# EAGLE schematic DINO (EAGLE 9.6.2)
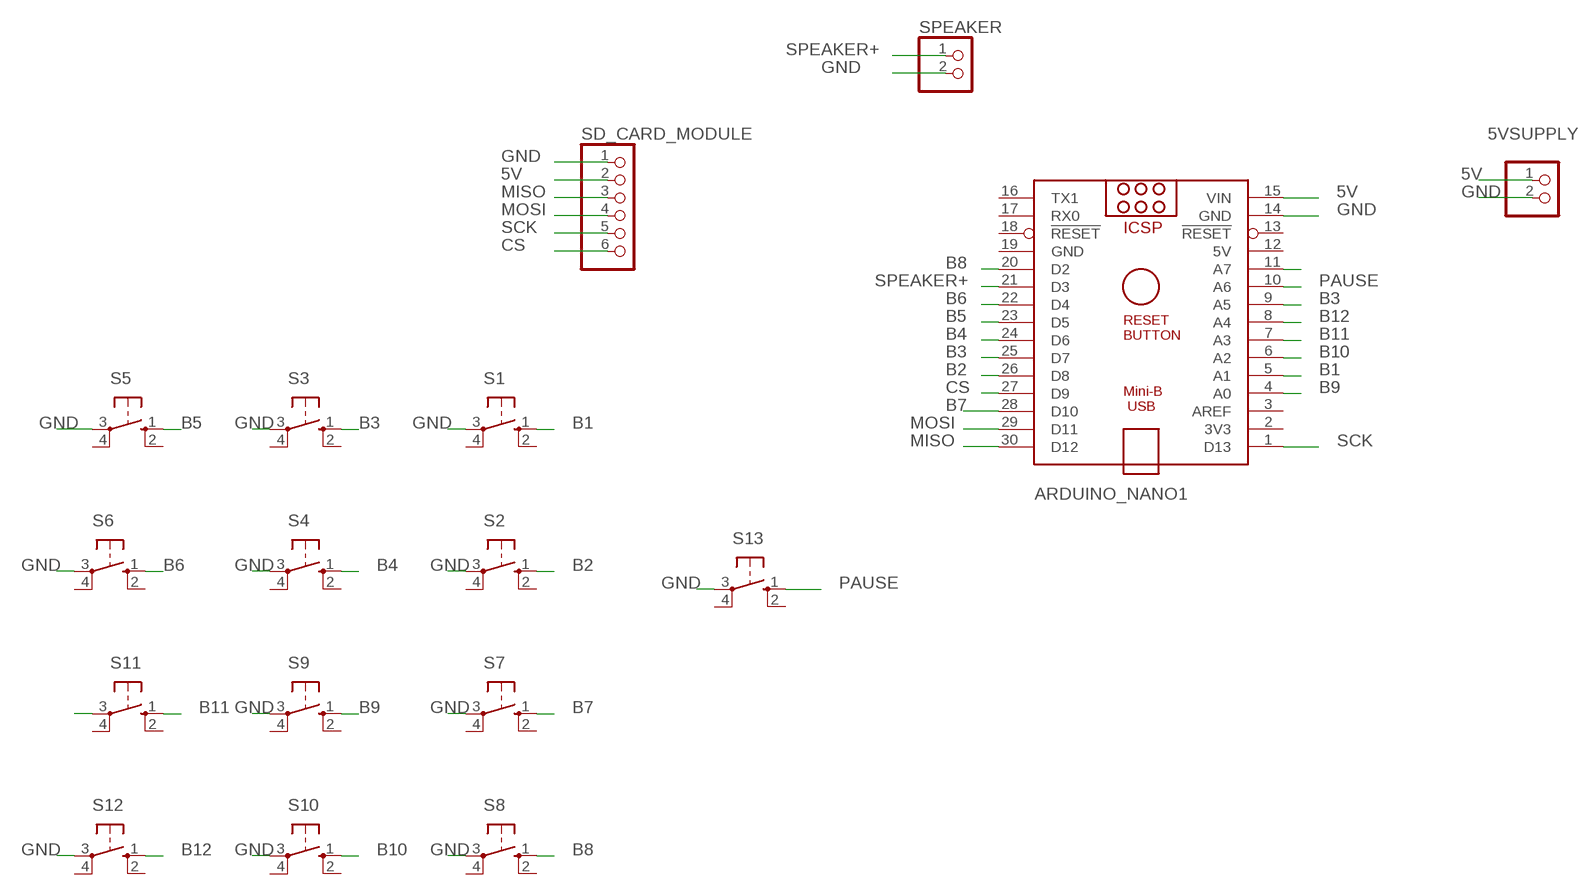
[diagram p0: schematic, sheet 1]

## Parts
5VSUPPLY  PINHD-1X2  [1X02]
ARDUINO_NANO1  ARDUINO_NANO  [ARDUINO_NANO]
S1  10-XX  [B3F-10XX]
S2  10-XX  [B3F-10XX]
S3  10-XX  [B3F-10XX]
S4  10-XX  [B3F-10XX]
S5  10-XX  [B3F-10XX]
S6  10-XX  [B3F-10XX]
S7  10-XX  [B3F-10XX]
S8  10-XX  [B3F-10XX]
S9  10-XX  [B3F-10XX]
S10  10-XX  [B3F-10XX]
S11  10-XX  [B3F-10XX]
S12  10-XX  [B3F-10XX]
S13  10-XX  [B3F-10XX]
SD_CARD_MODULE  PINHD-1X6  [1X06]
SPEAKER  PINHD-1X2  [1X02]

## Nets
5V: 5VSUPPLY.1 ARDUINO_NANO1.15(VIN) SD_CARD_MODULE.2
B1: ARDUINO_NANO1.5(A1) S1.1(S)
B2: ARDUINO_NANO1.26(D8) S2.1(S)
B3: ARDUINO_NANO1.9(A5) ARDUINO_NANO1.25(D7) S3.1(S)
B4: ARDUINO_NANO1.24(D6) S4.1(S)
B5: ARDUINO_NANO1.23(D5) S5.1(S)
B6: ARDUINO_NANO1.22(D4) S6.1(S)
B7: ARDUINO_NANO1.28(D10) S7.1(S)
B8: ARDUINO_NANO1.20(D2) S8.1(S)
B9: ARDUINO_NANO1.4(A0) S9.1(S)
B10: ARDUINO_NANO1.6(A2) S10.1(S)
B11: ARDUINO_NANO1.7(A3) S11.1(S)
B12: ARDUINO_NANO1.8(A4) S12.1(S)
CS: ARDUINO_NANO1.27(D9) SD_CARD_MODULE.6
GND: 5VSUPPLY.2 ARDUINO_NANO1.14(GND) S1.3(P) S2.3(P) S3.3(P) S4.3(P) S5.3(P) S6.3(P) S7.3(P) S8.3(P) S9.3(P) S10.3(P) S12.3(P) S13.3(P) SD_CARD_MODULE.1 SPEAKER.2
MISO: ARDUINO_NANO1.30(D12) SD_CARD_MODULE.3
MOSI: ARDUINO_NANO1.29(D11) SD_CARD_MODULE.4
N$7: S11.3(P)
N$10: ARDUINO_NANO1.11(A7)
PAUSE: ARDUINO_NANO1.10(A6) S13.1(S)
SCK: ARDUINO_NANO1.1(D13) SD_CARD_MODULE.5
SPEAKER+: ARDUINO_NANO1.21(D3) SPEAKER.1
Unconnected: ARDUINO_NANO1.2(3V3) ARDUINO_NANO1.3(AREF) ARDUINO_NANO1.13(!RESET) ARDUINO_NANO1.16(TX1) ARDUINO_NANO1.17(RX0) ARDUINO_NANO1.18(!RESET) S1.2(S1) S1.4(P1) S2.2(S1) S2.4(P1) S3.2(S1) S3.4(P1) S4.2(S1) S4.4(P1) S5.2(S1) S5.4(P1) S6.2(S1) S6.4(P1) S7.2(S1) S7.4(P1) S8.2(S1) S8.4(P1) S9.2(S1) S9.4(P1) S10.2(S1) S10.4(P1) S11.2(S1) S11.4(P1) S12.2(S1) S12.4(P1) S13.2(S1) S13.4(P1)

## Power pins joined to a net without a drawn wire
5V: ARDUINO_NANO1.12(5V)
GND: ARDUINO_NANO1.19(GND)

## Library data of the parts
5VSUPPLY SPEAKER = pinhead:PINHD-1X2: PIN HEADER
ARDUINO_NANO1 = ArduinoNanoV30:ARDUINO_NANO: Arduino Nano V3.0 Overview: The Arduino Nano is a small, complete, and breadboard-friendly board based on the ATmega328 (Arduino Nano 3.x) or ATmega168 (Arduino Nano 2.x). It has more or less the same functionality of the Arduino Duemilanove, but in a different package. It lacks only a DC power jack, and works with a Mini-B USB cable instead of a standard one. The Nano was designed and is being produced by Gravitech. Specifications: Microcontroller Atmel ATmega168 or ATmega328 Operating Voltage (logic level) 5 V Input Voltage (recommended) 7-12 V Input Voltage (limits) 6-20 V Digital I/O Pins 14 (of which 6 provide PWM output) Analog Input Pins 8 DC Current per I/O Pin 40 mA Flash Memory 16 KB (ATmega168) or 32 KB (ATmega328) of which 2 KB used by bootloader SRAM 1 KB (ATmega168) or 2 KB (ATmega328) EEPROM 512 bytes (ATmega168) or 1 KB (ATmega328) Clock Speed 16 MHz Dimensions 0.73" x 1.70" Length 45 mm Width 18 mm Weigth 5 g Power: The Arduino Nano can be powered via the Mini-B USB connection, 6-20V unregulated external power supply (pin 30), or 5V regulated external power supply (pin 27). The power source is automatically selected to the highest voltage source. Memory: The ATmega168 has 16 KB of flash memory for storing code (of which 2 KB is used for the bootloader); the ATmega328 has 32 KB, (also with 2 KB used for the bootloader). The ATmega168 has 1 KB of SRAM and 512 bytes of EEPROM (which can be read and written with the EEPROM library); the ATmega328 has 2 KB of SRAM and 1 KB of EEPROM. Input and Output: Each of the 14 digital pins on the Nano can be used as an input or output, using pinMode(), digitalWrite(), and digitalRead() functions. They operate at 5 volts. Each pin can provide or receive a maximum of 40 mA and has an internal pull-up resistor (disconnected by default) of 20-50 kOhms. In addition, some pins have specialized functions. Visit Arduino - ArduinoBoardNano <https://www.arduino.cc/en/Main/ArduinoBoardNano>
S1-S13 = switch-omron:10-XX: OMRON SWITCH; MPN: B3F-1000; OC_FARNELL: 176432; OC_NEWARK: 36M3542
SD_CARD_MODULE = pinhead:PINHD-1X6: PIN HEADER